# Altium schematic sheet SSR POWER STAGE.SchDoc
size A4; DocumentNumber: 10; SheetNumber: ALT0056; SheetTotal: 21
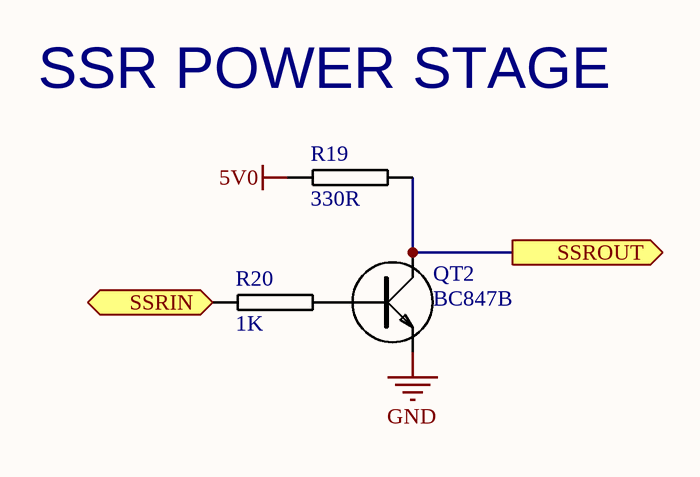
[diagram p0: SSR POWER STAGE.SchDoc]

## Parts
QT2  BC847B  [SOT23-BCE]
R19  330R  [0805R-330]
R20  1K  [0805R-1K]

## Ports
SSRIN (in), SSROUT (out)

## Nets
5V0: R19.1
GND: QT2.E
SSRIN: R20.1 ; port SSRIN
SSROUT: QT2.C R19.2 ; port SSROUT
NetQT2_B: QT2.B R20.2

## Notes on the sheet
- (near R19) SSR POWER STAGE
- Title
- Size:
- Date:
- A4
- Number:
- Time:
- Revision:
- Sheet
- of
- File:

## Library data of the parts
QT2 = BC847: BC847 SMALL SIGNAL NPN TRANSISTOR; Manufacturer Part Number: BC847BMTF; Manufacturer: Fairchild Semiconductor; Current - Collector (Ic) (Max): 100mA; Frequency - Transition: 300MHz; Vce Saturation (Max) @ Ib, Ic: 200mV @ 5mA, 100mA; Voltage - Collector Emitter Breakdown (Max): 45V; Power - Max: 310mW; DC Current Gain (hFE) (Min) @ Ic, Vce: 200 @ 2mA, 5V; Supplier 1: Digi-Key; Supplier Part Number 1: BC847BMTFCT-ND; RoHS: RoHS Compliant; Transistor Type: NPN; Mounting Type: Surface Mount; Packaging: Cut Tape (CT); Package / Case: SOT-23-3, TO-236-3, Micro3™, SSD3, SST3; Current - Collector Cutoff (Max): -; Supplier: Digi-Key; Category: Discrete Semiconductor Products; Supplier Part Number: BC847BMTFCT-ND
R19 = 0805R-330: RESISTOR 0805 1/4 WATT THIN FILM; Reel: *
R20 = 0805R-1K: RESISTOR 0805 1/4 WATT THIN FILM; Reel: *